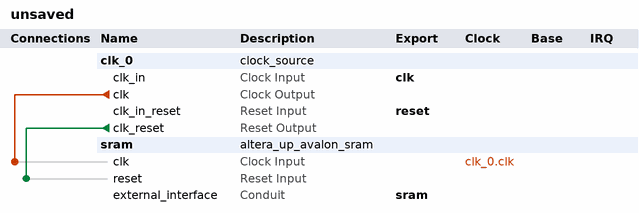
[diagram p0: system contents]
# Platform Designer (Qsys) system unsaved, Cyclone IV E EP4CE10E22A7
# Parameters at their usual value, and those the tool derives, are not listed.
package require -exact qsys 20.1
create_system unsaved
set_project_property DEVICE_FAMILY {Cyclone IV E}
set_project_property DEVICE EP4CE10E22A7

add_instance clk_0 clock_source 20.1
set_instance_parameter_value clk_0 clockFrequency 50000000

add_instance sram altera_up_avalon_sram 18.0
set_instance_parameter_value sram board DE2-115
set_instance_parameter_value sram pixel_buffer false

# connections
add_connection clk_0.clk sram.clk clock
add_connection clk_0.clk_reset sram.reset reset

# exported interfaces
add_interface clk clock sink
set_interface_property clk EXPORT_OF clk_0.clk_in
add_interface reset reset sink
set_interface_property reset EXPORT_OF clk_0.clk_in_reset
add_interface sram conduit end
set_interface_property sram EXPORT_OF sram.external_interface

set_interconnect_requirement {$system} qsys_mm.clockCrossingAdapter HANDSHAKE
set_interconnect_requirement {$system} qsys_mm.enableEccProtection FALSE
set_interconnect_requirement {$system} qsys_mm.insertDefaultSlave FALSE
set_interconnect_requirement {$system} qsys_mm.maxAdditionalLatency 1

save_system unsaved.qsys
